# Altium project LAN9252_REF.PrjPcb
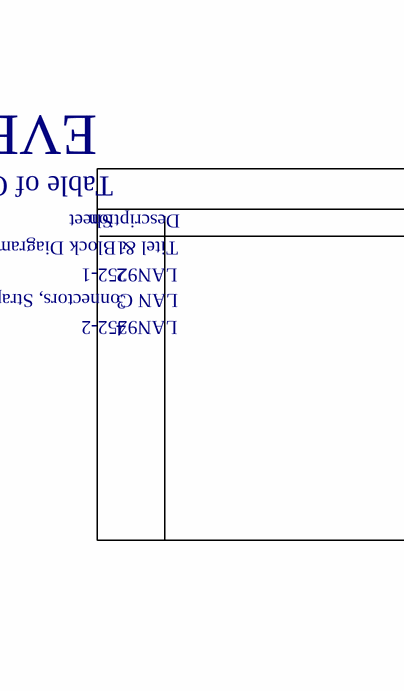
[diagram p0: UNG_8088_EVB_LAN9252-SPI_TitlePage.SchDoc, left]
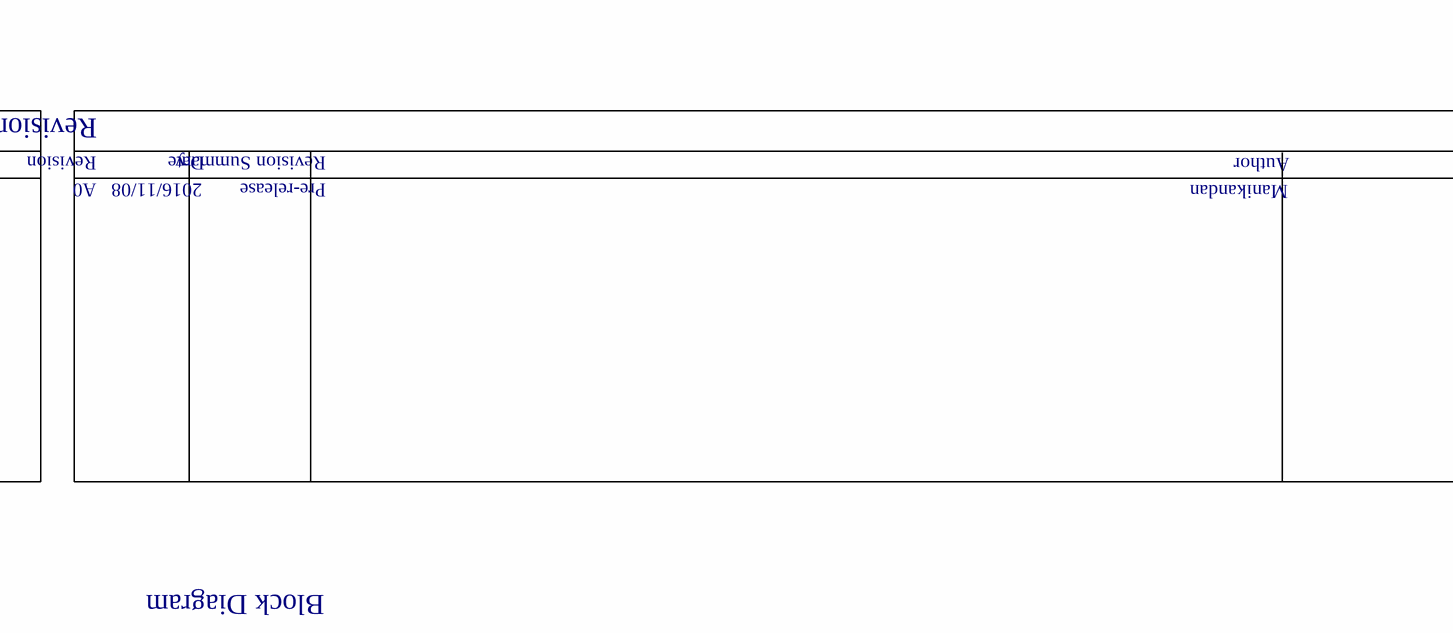
[diagram p1: UNG_8088_EVB_LAN9252-SPI_TitlePage.SchDoc, right]
1 sheet, 1 parts. Net scope: global (net labels, ports and power ports of the same name join across sheets).
Board file: UNG_8088_EVB_LAN9252-SPI.PcbDoc

## Sheet UNG_8088_EVB_LAN9252-SPI_TitlePage.SchDoc
size 416 x 264 mm; Revision: A0; SheetNumber: 1; SheetTotal: 4; PageSetup: Record=PageOptions|CenterHorizontal=True|CenterVertical=True|PrintScale=1.02|XCorrection=1.00|YCorrection=1.00|PrintKind=0|BorderSize=5000000|LeftOffset=0|BottomOffset=0|Orientation=2|PaperLength=1000|PaperWidth=1000|Scale=100|PaperSource=15|PrintQuality=-3|MediaType=1|DitherType=10|PrintScaleMode=1|PaperKind=11 x 17|PaperIndex=119; SheetTitle: Change Log; PageTitle: Title Page; ProjName: JUTLAND; DesignDescription: EVB_LAN9252-SPI; Designer: Manikandan; PartNumber: UNG_8088; DocumentFullPathAndName: //depot_np_hweng_boards/ung_hweng/UNG_8088_FDB_LAN9252-ADD-ON-forF28379D/

### Parts
?  (no value)  (graphical)

### Notes on the sheet
- EVB-LAN9252-SPI(FDB_LAN9252-ADD-ON-for-F2837xD)
- Table of Contents
- Sheet
- Description
- Revision History
- Revision
- Date
- Revision Summary
- Author
- 1
- 2
- 3
- LAN9252-1
- Titel & Block Diagram
- LAN Connectors, Strap & EEPROM
- A0
- 2016/11/08
- Pre-release
- Manikandan
- 4
- LAN9252-2
- DP
- Sink
- Block Diagram
- Microchip Technology, Inc.
  USB/Network Group - UNG
  www.Microchip.com
- Designed with
- Altium.com <http://go.altium.com/MicrochipLandingPage_Evaluation.html>
- Page Title:
- Project Name:
- Description:
- PN:
- Size:
- B
- Date:
- Designer:
- of
- Rev

### Library data of the parts
? = Title Block B_UNG1_Altium